# EAGLE schematic Slave Schematic (EAGLE 9.5.1)
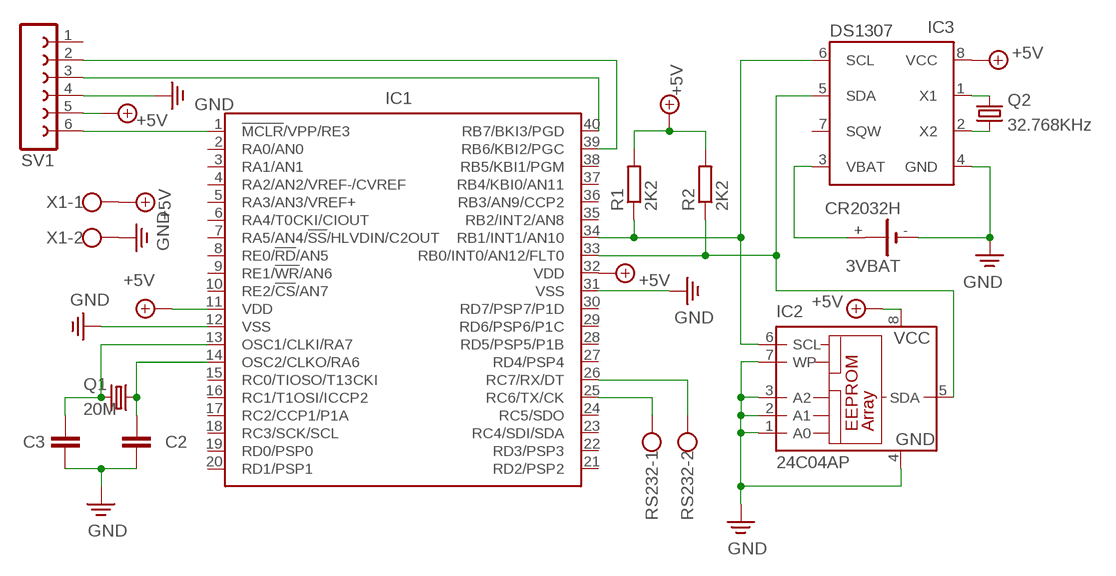
[diagram p0: schematic, sheet 1]

## Parts
3VBAT  CR2032H  [CR2032H]
C2  C-EU025-025X050  [C025-025X050]
C3  C-EU025-025X050  [C025-025X050]
IC1  PIC18F4620  [DIL40]
IC2  24C04AP  [DIL8]
IC3  DS1307  [DIL08]
Q1  20M  CRYSTALHC49S  [HC49/S]
Q2  32.768KHz  CRYSTALHC49S  [HC49/S]
R1  2K2  R-EU_0207/7  [0207/7]
R2  2K2  R-EU_0207/7  [0207/7]
RS232  W237-102  [W237-102]
SV1  FE06-1  [FE06]
X1  W237-102  [W237-102]

## Nets
+5V: IC1.11(VDD) IC1.32(VDD) IC2.8(VCC) IC3.8(VCC) R1.2 R2.2 SV1.5 X1.1
N$1: IC1.1(!MCLR!/VPP/RE3) SV1.6
N$2: C3.2 IC1.13(OSC1/CLKI/RA7) Q1.2
N$3: C2.1 IC1.14(OSC2/CLKO/RA6) Q1.1
N$4: IC1.40(RB7/BKI3/PGD) SV1.3
N$5: IC1.39(RB6/KBI2/PGC) SV1.2
N$6: IC1.25(RC6/TX/CK) RS232.1
N$7: IC1.26(RC7/RX/DT) RS232.2
N$9: IC1.34(RB1/INT1/AN10) IC2.6(SCL) IC3.6(SCL) R1.1
N$10: IC3.1(X1) Q2.2
N$11: IC1.33(RB0/INT0/AN12/FLT0) IC2.5(SDA) IC3.5(SDA) R2.1
N$12: IC3.2(X2) Q2.1
N$13: 3VBAT.+ IC3.3(VBAT)
PE: 3VBAT.- C2.2 C3.1 IC1.12(VSS) IC1.31(VSS) IC2.1(A0) IC2.2(A1) IC2.3(A2) IC2.4(GND) IC2.7(WP) IC3.4(GND) SV1.4 X1.2 ; supply symbol labelled GND
Unconnected: 3VBAT.+@1(+) IC1.2(RA0/AN0) IC1.3(RA1/AN1) IC1.4(RA2/AN2/VREF-/CVREF) IC1.5(RA3/AN3/VREF+) IC1.6(RA4/T0CKI/CIOUT) IC1.7(RA5/AN4/!SS!/HLVDIN/C2OUT) IC1.8(RE0/!RD!/AN5) IC1.9(RE1/!WR!/AN6) IC1.10(RE2/!CS!/AN7) IC1.15(RC0/TIOSO/T13CKI) IC1.16(RC1/T1OSI/ICCP2) IC1.17(RC2/CCP1/P1A) IC1.18(RC3/SCK/SCL) IC1.19(RD0/PSP0) IC1.20(RD1/PSP1) IC1.21(RD2/PSP2) IC1.22(RD3/PSP3) IC1.23(RC4/SDI/SDA) IC1.24(RC5/SDO) IC1.27(RD4/PSP4) IC1.28(RD5/PSP5/P1B) IC1.29(RD6/PSP6/P1C) IC1.30(RD7/PSP7/P1D) IC1.35(RB2/INT2/AN8) IC1.36(RB3/AN9/CCP2) IC1.37(RB4/KBI0/AN11) IC1.38(RB5/KBI1/PGM) IC3.7(SQW) SV1.1

## Library data of the parts
3VBAT = battery:CR2032H: LI BATTERY Varta
C2 C3 = rcl:C-EU: CAPACITOR, European symbol; SPICEPREFIX: C
IC1 = Didash's:PIC18F4620: 28/40/44-Pin Enhanced Flash Microcontrollers with 10-Bit A/D and nanoWatt Technology
IC2 = microchip:24*: Serial EEPROM I2C; MF: RAMTRON INTERNATIONAL CORP; MPN: FM24C04A-P; OC_FARNELL: 1094258; OC_NEWARK: 97H6447
IC3 = ds1307_pcf8583:DS1307: I2C-Bus CLOCK/CALENDAR
Q1 Q2 = crystal:CRYSTAL: CRYSTAL; OC_FARNELL: 1667008; OC_NEWARK: unknown
R1 R2 = rcl:R-EU_: RESISTOR, European symbol; SPICEPREFIX: R
RS232 X1 = con-wago-500:W237-102: WAGO SCREW CLAMP; MPN: 237-102; OC_FARNELL: unknown; OC_NEWARK: 70K9898
SV1 = con-lsta:FE06-1: FEMALE HEADER; OC_FARNELL: unknown; OC_NEWARK: unknown